# EAGLE design etchtest (EAGLE 5.11)
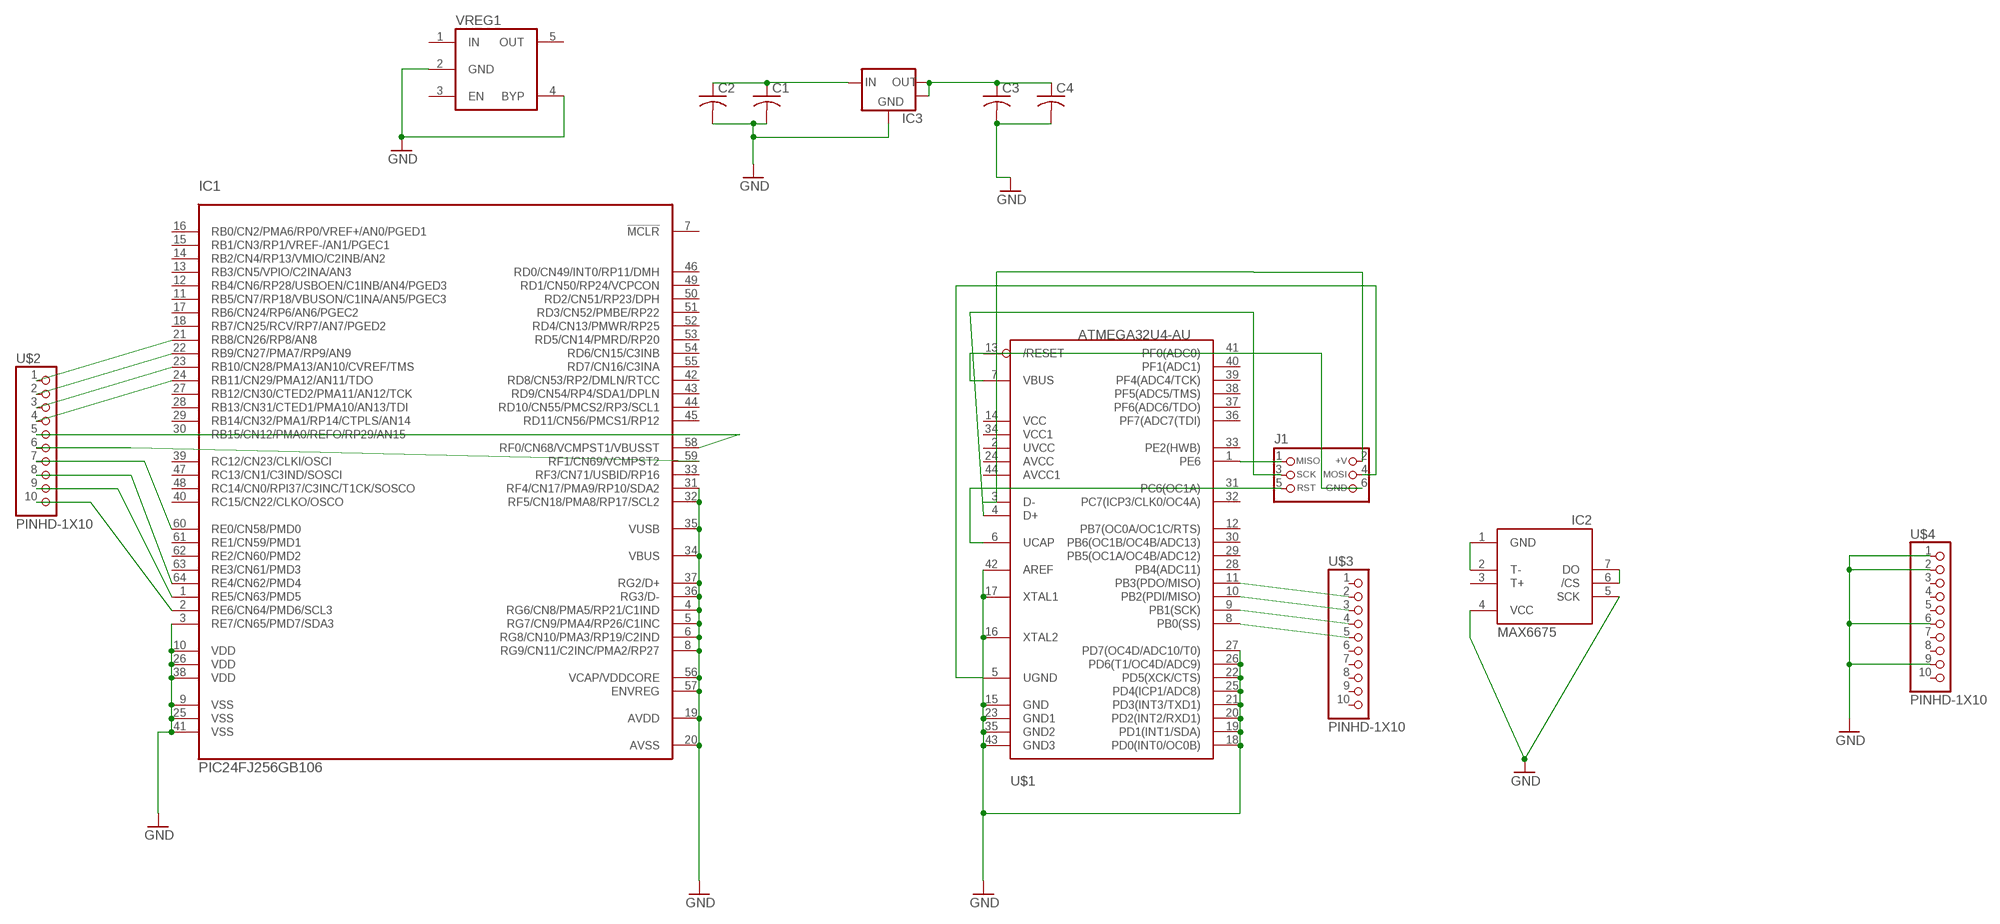
[diagram p0: schematic, sheet 1]

## Parts
C1  C-USC0603  [C0603]
C2  C-USC0603  [C0603]
C3  C-USC0805  [C0805]
C4  C-USC0805  [C0805]
IC1  PIC24FJ256GB106  [TQFP64-10X10]
IC2  MAX6675  [SO08]
IC3  V_REG_LM1117SOT223  [SOT223]
J1  CON_HEADER_PRG_AVR_ICSP_ETCH  [HEADER_PRG_2X03_ETCH]
U$1  ATMEGA32U4-AU  [TQFP44]
U$2  PINHD-1X10  [1X10-BIG]
U$3  PINHD-1X10  [1X10-BIG]
U$4  PINHD-1X10  [1X10-BIG]
VREG1  IC_VREG_5PINS-SOT-23-5  [SOT-23-5]

## Nets
GND: C1.2 C2.2 C3.2 C4.2 IC1.3(RE7/CN65/PMD7/SDA3) IC1.4(RG6/CN8/PMA5/RP21/C1IND) IC1.5(RG7/CN9/PMA4/RP26/C1INC) IC1.6(RG8/CN10/PMA3/RP19/C2IND) IC1.8(RG9/CN11/C2INC/PMA2/RP27) IC1.9(VSS) IC1.10(VDD) IC1.19(AVDD) IC1.20(AVSS) IC1.25(VSS) IC1.26(VDD) IC1.31(RF4/CN17/PMA9/RP10/SDA2) IC1.32(RF5/CN18/PMA8/RP17/SCL2) IC1.34(VBUS) IC1.35(VUSB) IC1.36(RG3/D-) IC1.37(RG2/D+) IC1.38(VDD) IC1.41(VSS) IC1.56(VCAP/VDDCORE) IC1.57(ENVREG) IC2.4(VCC) IC2.5(SCK) IC3.1(GND) U$1.15(GND) U$1.16(XTAL2) U$1.17(XTAL1) U$1.18(PD0(INT0/OC0B)) U$1.19(PD1(INT1/SDA)) U$1.20(PD2(INT2/RXD1)) U$1.21(PD3(INT3/TXD1)) U$1.22(PD5(XCK/CTS)) U$1.23(GND1) U$1.25(PD4(ICP1/ADC8)) U$1.26(PD6(T1/OC4D/ADC9)) U$1.27(PD7(OC4D/ADC10/T0)) U$1.35(GND2) U$1.42(AREF) U$1.43(GND3) U$4.1 U$4.2 U$4.6 U$4.9 VREG1.2(GND) VREG1.4(BYP)
N$1: IC1.60(RE0/CN58/PMD0) U$2.7
N$2: IC1.59(RF1/CN69/VCMPST2) U$2.6
N$3: IC1.58(RF0/CN68/VCMPST1/VBUSST) U$2.5
N$4: IC1.24(RB11/CN29/PMA12/AN11/TDO) U$2.4
N$5: IC1.23(RB10/CN28/PMA13/AN10/CVREF/TMS) U$2.3
N$6: IC1.22(RB9/CN27/PMA7/RP9/AN9) U$2.2
N$7: IC1.21(RB8/CN26/RP8/AN8) U$2.1
N$8: IC1.64(RE4/CN62/PMD4) U$2.8
N$9: IC1.1(RE5/CN63/PMD5) U$2.9
N$10: IC1.2(RE6/CN64/PMD6/SCL3) U$2.10
N$11: J1.1(MISO) U$1.1(PE6)
N$12: J1.2(+V) U$1.3(D-)
N$13: J1.3(SCK) U$1.4(D+)
N$14: J1.4(MOSI) U$1.5(UGND)
N$15: J1.5(RST) U$1.6(UCAP)
N$16: J1.6(GND) U$1.7(VBUS)
N$17: C1.1 C2.1 IC3.3(IN)
N$27: U$1.8(PB0(SS)) U$3.5
N$28: U$1.9(PB1(SCK)) U$3.4
N$29: U$1.10(PB2(PDI/MISO)) U$3.3
N$30: U$1.11(PB3(PDO/MISO)) U$3.2
N$31: IC2.1(GND) IC2.2(T-)
N$32: IC2.6(/CS) IC2.7(DO)
OUT: C3.1 C4.1 IC3.2(VR-OUTSM) IC3.4(OUT)
Unconnected: IC1.7(!MCLR) IC1.11(RB5/CN7/RP18/VBUSON/C1INA/AN5/PGEC3) IC1.12(RB4/CN6/RP28/USBOEN/C1INB/AN4/PGED3) IC1.13(RB3/CN5/VPIO/C2INA/AN3) IC1.14(RB2/CN4/RP13/VMIO/C2INB/AN2) IC1.15(RB1/CN3/RP1/VREF-/AN1/PGEC1) IC1.16(RB0/CN2/PMA6/RP0/VREF+/AN0/PGED1) IC1.17(RB6/CN24/RP6/AN6/PGEC2) IC1.18(RB7/CN25/RCV/RP7/AN7/PGED2) IC1.27(RB12/CN30/CTED2/PMA11/AN12/TCK) IC1.28(RB13/CN31/CTED1/PMA10/AN13/TDI) IC1.29(RB14/CN32/PMA1/RP14/CTPLS/AN14) IC1.30(RB15/CN12/PMA0/REFO/RP29/AN15) IC1.33(RF3/CN71/USBID/RP16) IC1.39(RC12/CN23/CLKI/OSCI) IC1.40(RC15/CN22/CLKO/OSCO) IC1.42(RD8/CN53/RP2/DMLN/RTCC) IC1.43(RD9/CN54/RP4/SDA1/DPLN) IC1.44(RD10/CN55/PMCS2/RP3/SCL1) IC1.45(RD11/CN56/PMCS1/RP12) IC1.46(RD0/CN49/INT0/RP11/DMH) IC1.47(RC13/CN1/C3IND/SOSCI) IC1.48(RC14/CN0/RPI37/C3INC/T1CK/SOSCO) IC1.49(RD1/CN50/RP24/VCPCON) IC1.50(RD2/CN51/RP23/DPH) IC1.51(RD3/CN52/PMBE/RP22) IC1.52(RD4/CN13/PMWR/RP25) IC1.53(RD5/CN14/PMRD/RP20) IC1.54(RD6/CN15/C3INB) IC1.55(RD7/CN16/C3INA) IC1.61(RE1/CN59/PMD1) IC1.62(RE2/CN60/PMD2) IC1.63(RE3/CN61/PMD3) IC2.3(T+) U$1.2(UVCC) U$1.12(PB7(OC0A/OC1C/RTS)) U$1.13(/RESET) U$1.14(VCC) U$1.24(AVCC) U$1.28(PB4(ADC11)) U$1.29(PB5(OC1A/OC4B/ADC12)) U$1.30(PB6(OC1B/OC4B/ADC13)) U$1.31(PC6(OC1A)) U$1.32(PC7(ICP3/CLK0/OC4A)) U$1.33(PE2(HWB)) U$1.34(VCC1) U$1.36(PF7(ADC7(TDI)) U$1.37(PF6(ADC6/TDO)) U$1.38(PF5(ADC5/TMS)) U$1.39(PF4(ADC4/TCK)) U$1.40(PF1(ADC1)) U$1.41(PF0(ADC0)) U$1.44(AVCC1) U$3.1 U$3.6 U$3.7 U$3.8 U$3.9 U$3.10 U$4.3 U$4.4 U$4.5 U$4.7 U$4.8 U$4.10 VREG1.1(IN) VREG1.3(EN) VREG1.5(OUT)

## Library data of the parts
C1-C4 = LL:C-US: CAPACITOR, American symbol
IC1 = LL:PIC24FJ256GB106: 16-Bit Flash Microcontroller with USB On-The-Go(OTG)
IC2 = adafruit:MAX6675
IC3 = LL:V_REG_LM1117: Voltage Regulator LM1117 Standard adjustable voltage regulator but in SMD form. Fixed voltage type.
J1 = LL:CON_HEADER_PRG_AVR_ICSP_ETCH: 2x3 AVR ICSP programming header for etching
U$1 = adafruit:ATMEGA32U4: http://www.ladyada.net/library/eagle
U$2-U$4 = adafruit:PINHD-1X10: Pin header 1x10 0.1" spacing With round pins
VREG1 = dp_devices:IC_VREG_5PINS: 5 pins voltage regulator

## Board
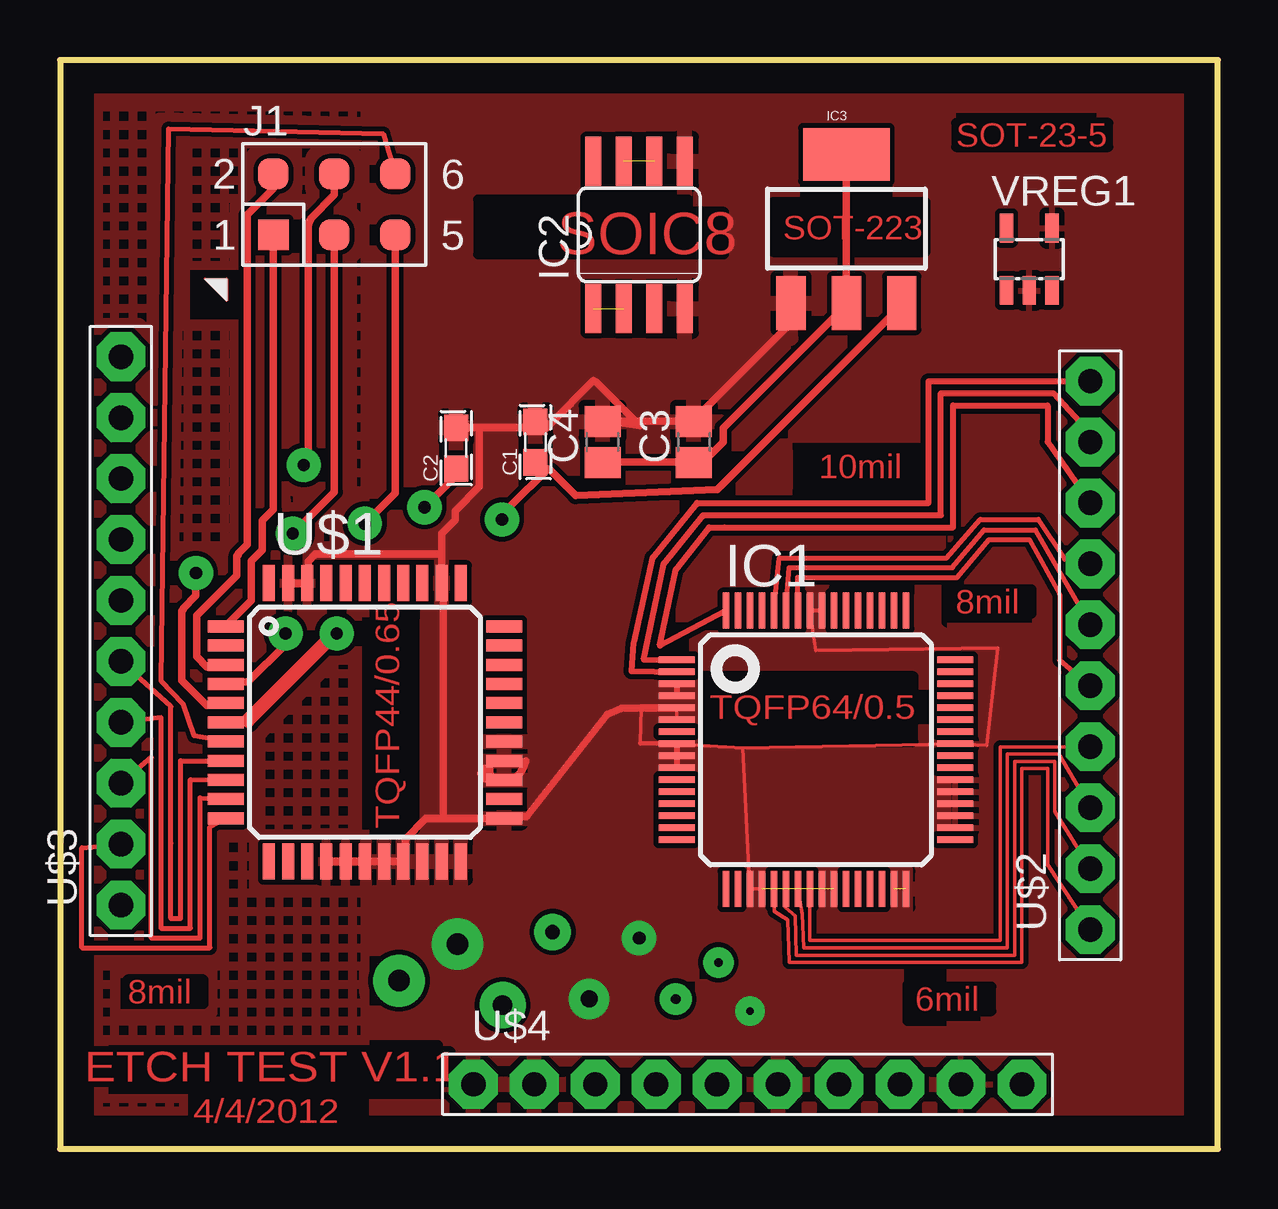
[diagram p1: board, top side]
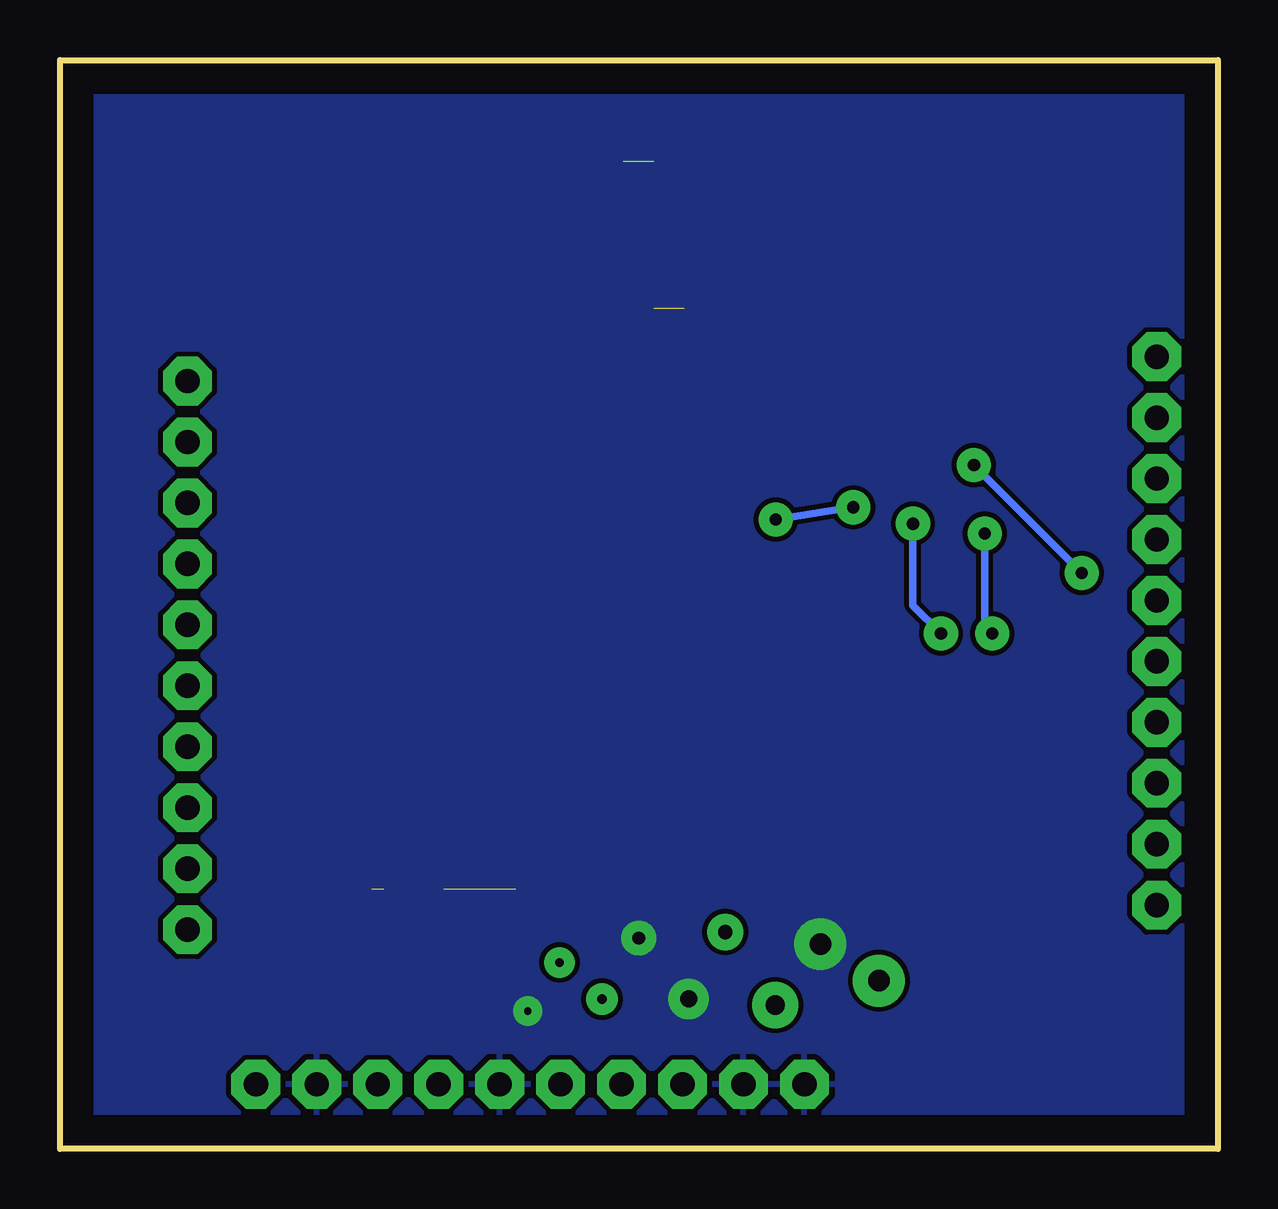
[diagram p2: board, bottom side, seen from below]

Size 48.24 x 45.39 mm. Coordinates in mm from the lower left corner, seen from the top.
Outline: 0,0 48.24,0 48.24,45.39 0,45.39 0,0
Copper layers (1*16): Top 0.0356mm / dielectric 1.5011mm / Bottom 0.0356mm
Design rules "LL-Etch": minimum track width 12mil, minimum drill 21mil, track to track 8mil, track to pad 12mil, pad to pad 18mil, via to via 20mil, smd to smd 4mil, copper to edge 50mil, drill to drill 30mil, minimum pad ring 20mil, minimum via ring 18mil, stop-mask expansion 0mil, vias tented up to drill 20mil, thermal gap 10mil
tRestrict: area 36.9,21.9 to 40.5,23.5; area 26.8,17 to 35.6,19.7; area 30.7,27.4 to 35.6,29.2; area 12.6,13.3 to 14.8,22.1; area 17.4,37.3 to 26.2,39.6; area 5.4,34.6 to 7.4,36.6; area 29.7,37.4 to 36.1,39.5; area 2.5,5.8 to 5.6,7.1; area 2,2.3 to 15.7,4.3; area 5.6,0.8 to 11.4,2.3; area 35.3,5.3 to 38.4,6.9; area 37.3,41.7 to 43.2,43.2

### Footprints (pad centres in the part's own frame; a part is rotated, then mirrored left to right if it is on the bottom)
C0603 = smd 1.1 x 1: 1 -0.85,0; 2 0.85,0
C0805 = smd 1.3 x 1.5: 1 -0.85,0; 2 0.85,0
TQFP64-10X10 = smd 1.5 x 0.28: 1 -5.8,3.75; 2 -5.8,3.25; 3 -5.8,2.75; 4 -5.8,2.25; 5 -5.8,1.75; 6 -5.8,1.25; 7 -5.8,0.75; 8 -5.8,0.25; 9 -5.8,-0.25; 10 -5.8,-0.75; 11 -5.8,-1.25; 12 -5.8,-1.75; 13 -5.8,-2.25; 14 -5.8,-2.75; 15 -5.8,-3.25; 16 -5.8,-3.75; 33 5.8,-3.75; 34 5.8,-3.25; 35 5.8,-2.75; 36 5.8,-2.25; 37 5.8,-1.75; 38 5.8,-1.25; 39 5.8,-0.75; 40 5.8,-0.25; 41 5.8,0.25; 42 5.8,0.75; 43 5.8,1.25; 44 5.8,1.75; 45 5.8,2.25; 46 5.8,2.75; 47 5.8,3.25; 48 5.8,3.75 | smd 0.28 x 1.5: 17 -3.75,-5.8; 18 -3.25,-5.8; 19 -2.75,-5.8; 20 -2.25,-5.8; 21 -1.75,-5.8; 22 -1.25,-5.8; 23 -0.75,-5.8; 24 -0.25,-5.8; 25 0.25,-5.8; 26 0.75,-5.8; 27 1.25,-5.8; 28 1.75,-5.8; 29 2.25,-5.8; 30 2.75,-5.8; 31 3.25,-5.8; 32 3.75,-5.8; 49 3.75,5.8; 50 3.25,5.8; 51 2.75,5.8; 52 2.25,5.8; 53 1.75,5.8; 54 1.25,5.8; 55 0.75,5.8; 56 0.25,5.8; 57 -0.25,5.8; 58 -0.75,5.8; 59 -1.25,5.8; 60 -1.75,5.8; 61 -2.25,5.8; 62 -2.75,5.8; 63 -3.25,5.8; 64 -3.75,5.8
SO08 = smd 0.66 x 2.032: 1 -1.905,-3.073; 2 -0.635,-3.073; 3 0.635,-3.073; 4 1.905,-3.073; 5 1.905,3.073; 6 0.635,3.073; 7 -0.635,3.073; 8 -1.905,3.073
SOT223 = smd 1.219 x 2.235: 1 -2.311,-3.099; 2 0,-3.099; 3 2.311,-3.099 | smd 3.6 x 2.2: 4 0,3.099
HEADER_PRG_2X03_ETCH = smd 1.27 x 1.27: 1 -2.54,-1.27; 2 -2.54,1.27; 3 0,-1.27; 4 0,1.27; 5 2.54,-1.27; 6 2.54,1.27
TQFP44 = smd 1.5 x 0.5: 1 -5.8,4; 2 -5.8,3.2; 3 -5.8,2.4; 4 -5.8,1.6; 5 -5.8,0.8; 6 -5.8,0; 7 -5.8,-0.8; 8 -5.8,-1.6; 9 -5.8,-2.4; 10 -5.8,-3.2; 11 -5.8,-4; 23 5.8,-4; 24 5.8,-3.2; 25 5.8,-2.4; 26 5.8,-1.6; 27 5.8,-0.8; 28 5.8,0; 29 5.8,0.8; 30 5.8,1.6; 31 5.8,2.4; 32 5.8,3.2; 33 5.8,4 | smd 0.5 x 1.5: 12 -4,-5.8; 13 -3.2,-5.8; 14 -2.4,-5.8; 15 -1.6,-5.8; 16 -0.8,-5.8; 17 0,-5.8; 18 0.8,-5.8; 19 1.6,-5.8; 20 2.4,-5.8; 21 3.2,-5.8; 22 4,-5.8; 34 4,5.8; 35 3.2,5.8; 36 2.4,5.8; 37 1.6,5.8; 38 0.8,5.8; 39 0,5.8; 40 -0.8,5.8; 41 -1.6,5.8; 42 -2.4,5.8; 43 -3.2,5.8; 44 -4,5.8
1X10-BIG = drill 1.016 pad 1.778 octagon: 1 -11.43,0; 2 -8.89,0; 3 -6.35,0; 4 -3.81,0; 5 -1.27,0; 6 1.27,0; 7 3.81,0; 8 6.35,0; 9 8.89,0; 10 11.43,0
SOT-23-5 = smd 0.55 x 1.2: 1 -0.95,-1.3; 2 0,-1.3; 3 0.95,-1.3; 4 0.95,1.3; 5 -0.95,1.3

### Placement (x,y rotation side)
C1  19.81,29.46 90 top
C2  16.51,29.21 90 top
C3  26.42,29.46 90 top
C4  22.61,29.46 90 top
IC1  31.5,16.64 0 top
IC2  24.13,38.1 0 top
IC3  32.77,38.35 0 top
J1  11.43,39.37 0 top
U$1  12.7,17.78 0 top
U$2  42.93,20.57 90 top
U$3  2.54,21.59 90 top
U$4  28.65,2.69 0 top
VREG1  40.39,37.08 0 top

### Tracks (layer width: path | path; a pad name or v marks a point on that pad's centre or on a via)
GND  (via drill 0.3, 0.53, 0.7, 0.9)  (3 unrouted)
  Top 0.152: IC1.20 IC1.19 28.45,16.71 | IC1.8 28.45,16.71 | 24.23,18.37 24.18,16.92 | IC1.5 IC1.6 | 28.45,16.71 IC1.41 38.61,16.82 39.06,20.88 31.5,20.78 IC1.57 IC1.56
  Top 0.203: 24.18,16.92 IC1.8
  Top 0.254: IC1.3 IC1.4 | IC1.8 IC1.9 IC1.10
  Top 0.305: U$1.15 11.12,11.99 11.89,11.99 U$1.16 12.04,11.99 U$1.17 12.83,11.99 13.49,11.99 U$1.18 13.64,11.99 14.28,11.99 U$1.19 14.3,12.14 14.38,12.22 14.38,12.9 15.24,13.77 15.98,13.77 | 15.98,13.77 18.49,13.77 U$1.23 18.64,13.82 18.69,13.87 19.46,13.87 22.81,18.11 23.39,18.36 24.23,18.37 IC1.5 | IC3.1 30.45,34.42 26.49,30.45 C3.2 26.42,30.33 22.61,30.33 C4.2 22.48,30.4 24.16,30.15 22.35,31.95 22.23,32.03 20.4,30.2 C1.2 20.32,30.07 17.48,30.07 | U$1.43 9.53,23.57 10.29,23.57 U$1.42 10.34,23.72 10.34,24.49 10.64,24.79 15.77,24.79 15.9,24.79 | 17.48,30.07 16.51,30.07 C2.2 | 15.9,24.79 15.9,25.65 16.46,26.21 16.46,26.59 17.48,27.61 17.48,29.95 17.48,30.07 | 15.9,24.79 15.9,23.6 U$1.35 15.98,23.44 15.98,13.89 15.98,13.77 | 19.41,16.18 19.3,15.88 19.25,15.82 19.25,15.8 19.23,15.77 19.23,15.72 18.9,15.39 18.54,15.39 18.52,15.37 U$1.25 18.36,15.42 18.34,15.39 17.78,15.39 17.78,15.42 17.75,15.44 17.68,15.44 17.65,15.47 17.68,15.49 17.68,15.54 17.6,15.54 17.6,15.62 17.53,15.62 17.53,15.65 17.65,15.77 17.65,15.8 17.7,15.85 17.73,15.85 17.73,15.82 17.75,15.82 17.75,15.77 17.8,15.77 17.8,15.75 17.78,15.72 17.8,15.7 17.83,15.72 17.86,15.72 17.86,15.65 17.88,15.65 17.88,15.67 17.91,15.7 17.91,15.82 17.88,15.82 17.83,15.77 17.8,15.8 17.78,15.8 17.78,15.82 17.91,15.95 17.91,15.98 18.11,16.18 18.16,16.18 18.19,16.2 U$1.26
  other vias: 16.56,8.53 24.13,8.79 28.75,5.74 22.05,6.25
  pour Top: 48.11,0.2 48.16,45.42 37.08,45.21 37.03,0.1 45.72,0.1
  pour Top (isolate 0.203): 12.95,44.45 36.83,44.45 36.83,0.51 13.21,0.25
  pour Top (hatched): -0.25,45.72 12.7,44.45 12.7,0.25 0,0.25
  pour Bottom: -0.25,45.72 48.51,45.72 48.51,0 0.51,0.25
N$1
  Top 0.203: U$2.7 41.86,24.59 40.77,26.24 38.35,26.24 36.96,24.64 29.97,24.64 IC1.60
N$2
  Top 0.203: U$2.6 40.64,25.81 38.51,25.81 37.19,24.23 30.38,24.23 IC1.59
N$3
  Top 0.203: IC1.58 30.73,23.82 37.39,23.82 38.71,25.4 40.39,25.4 41.66,23.11 41.66,20.37 U$2.5
N$4
  Top 0.152: U$2.4 39.17,16.76 39.17,8.69 31.24,8.69 IC1.24
N$5
  Top 0.152: U$2.3 41.6,16.46 39.47,16.46 39.47,8.38 30.99,8.38 30.94,9.8 IC1.23
N$6
  Top 0.152: U$2.2 41.45,14.07 41.45,16.15 39.78,16.15 39.78,8.08 30.68,8.08 30.63,9.7 30.23,10.06 IC1.22
N$7
  Top 0.152: U$2.1 41.15,11.84 41.15,15.85 40.08,15.85 40.08,7.77 30.38,7.77 30.33,9.55 29.77,9.91 IC1.21
N$8
  Top 0.254: U$2.8 41.15,29.46 41.15,30.99 37.21,30.99 37.21,25.91 27.69,25.91 27.05,25.91 25.65,24.13 24.99,20.98 IC1.64
N$9
  Top 0.254: U$2.9 42.93,29.84 41.4,31.5 36.7,31.5 36.7,26.42 26.8,26.42 25.15,24.38 24.33,20.4 IC1.1
N$10
  Top 0.254: U$2.10 36.2,32 36.2,26.92 26.54,26.92 24.69,24.64 23.93,21.13 23.9,21.08 23.82,19.91 IC1.2
N$11
  Top 0.305: J1.1 8.89,26.64 8.43,26.19 8.43,24.97 7.98,24.51 7.98,22.86 6.91,21.79 U$1.1
N$12
  Top 0.305: J1.2 8.89,40.03 7.8,38.94 7.8,25.2 7.42,24.82 7.42,24.77 7.37,24.71 7.37,23.9 5.69,22.23 5.69,20.52 6.12,20.09 6.81,20.09 6.88,20.17 U$1.3
N$13  (via drill 0.51)
  Top 0.305: J1.3 11.43,27.38 v9.7,25.65 | v9.4,21.49 9.4,21.03 7.82,19.46 6.99,19.46 U$1.4
  Bottom 0.305: v9.7,25.65 9.7,21.79 v9.4,21.49
N$14  (via drill 0.51)
  Top 0.305: J1.4 11.43,39.78 10.44,38.79 10.44,38.73 10.41,38.71 10.41,38.66 10.36,38.61 10.36,38.53 10.34,38.51 10.34,28.68 v10.16,28.5 | v5.66,24 5.66,23.06 5.13,22.53 5.13,22.48 5.08,22.43 5.08,19.53 6.12,18.49 6.81,18.49 6.88,18.57 U$1.5
  Bottom 0.305: v5.66,24 v10.16,28.5
N$15  (via drill 0.51)
  Top 0.305: J1.5 13.97,27.33 v12.7,26.06 | 11.46,21.49 v11.53,21.49 | 7.82,17.86 6.99,17.86 U$1.6
  Top 0.584: 7.82,17.86 11.46,21.49
  Bottom 0.305: v12.7,26.06 12.7,22.66 v11.53,21.49
N$16
  Top 0.203: U$1.7 5.59,17.22 5.13,18.54 4.22,19.51 4.52,42.52 13.46,42.32 J1.6
N$17  (via drill 0.51)
  Top 0.305: v15.19,26.75 16.51,28.07 16.51,28.35 C2.1 | v18.41,26.24 18.72,26.75 20.32,28.35 C1.1 20.45,28.27 21.49,27.23 27.38,27.48 35.08,35.18 IC3.3
  Bottom 0.305: v15.19,26.75 v18.41,26.24
N$18  (via drill 0.9)
  other vias: 14.12,7.01
N$20  (via drill 0.8)
  other vias: 18.44,5.99
N$22  (via drill 0.6)
  other vias: 20.52,9.04
N$24  (via drill 0.41)
  other vias: 25.65,6.25
N$25  (via drill 0.36)
  other vias: 27.43,7.77
N$27
  Top 0.203: U$1.8 5.03,16.18 5.03,9.6 4.62,9.6 4.62,12.75 4.62,18.44 U$3.5
N$28
  Top 0.203: U$1.9 5.44,15.39 5.44,9.2 4.22,9.2 4.22,17.98 U$3.4
N$29
  Top 0.203: U$1.10 5.84,14.63 5.84,8.79 3.81,8.79 3.81,16.31 U$3.3
N$30
  Top 0.203: U$1.11 6.25,13.41 6.25,8.38 0.91,8.38 0.91,12.55 U$3.2
N$31  (1 unrouted)
N$32  (1 unrouted)
OUT
  Top 0.305: C4.1 22.61,28.63 26.42,28.63 C3.1 26.54,28.7 26.87,28.7 27.64,29.46 27.64,30.05 32.72,35.13 IC3.2 IC3.4 | IC3.4

### Text on the board
Top: SOT-23-5 | SOT-223 | SOIC8 | 10mil | 8mil | TQFP64/0.5 | TQFP44/0.65 | 8mil | 6mil | ETCH TEST V1.1 | 4/4/2012